# EAGLE schematic quad-hybrid-QCN-19D+ (EAGLE 9.5.1)
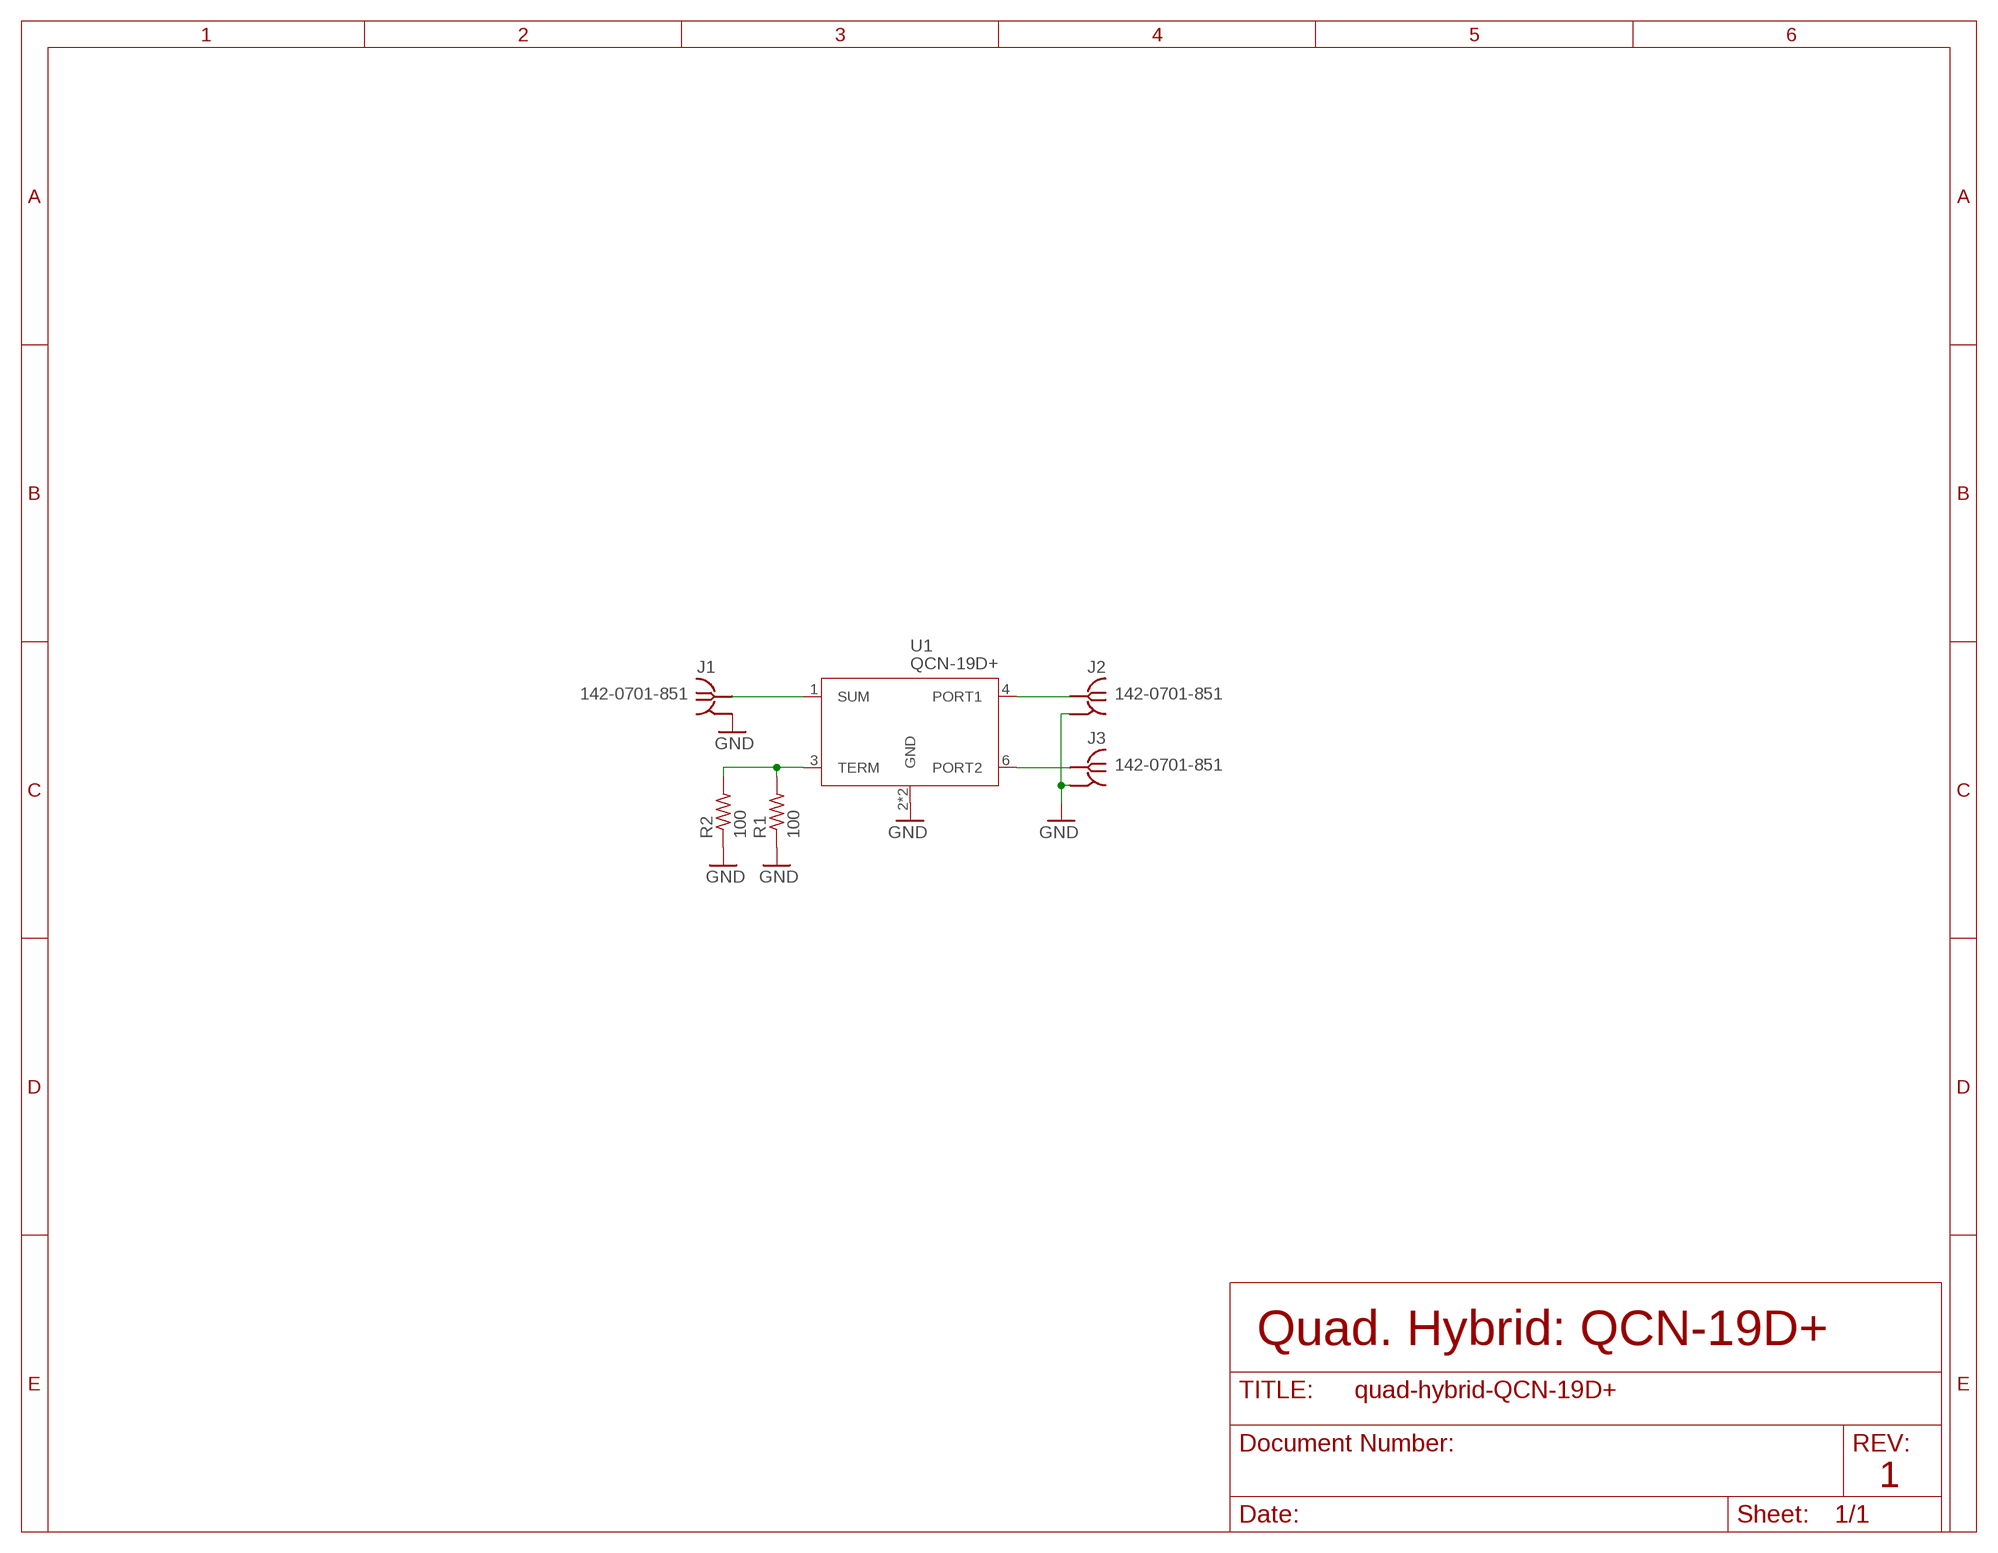
[diagram p0: schematic, sheet 1]

## Parts
J1  142-0701-851  [142-0701-851]
J2  142-0701-851  [142-0701-851]
J3  142-0701-851  [142-0701-851]
R1  100  R-US_0402-C-NOSILK  [.0402-C-NOSILK]
R2  100  R-US_0402-C-NOSILK  [.0402-C-NOSILK]
U1  QCN-19D+  [QCN-19D+]

## Nets
GND: J1.GND1(GND) J1.GND2(GND) J1.GND3(GND) J1.GND4(GND) J2.GND1(GND) J2.GND2(GND) J2.GND3(GND) J2.GND4(GND) J3.GND1(GND) J3.GND2(GND) J3.GND3(GND) J3.GND4(GND) R1.1 R2.1 U1.2(GND) U1.5(GND)
PORT1 [RF]: J2.RF1(RF) U1.4(PORT1)
PORT2 [RF]: J3.RF1(RF) U1.6(PORT2)
SUM [RF]: J1.RF1(RF) U1.1(SUM)
TERM: R1.2 R2.2 U1.3(TERM)

## Notes on the sheet
- Quad. Hybrid: QCN-19D+
- 1

## Library data of the parts
J1-J3 = J-Cinch-142-0701-851-SMA-end-launch:142-0701-851: SMA Jack 50Ω - End Launch Source: Datasheet <https://belfuse.com/resources/productinformations/cinchconnectivitysolutions/johnson/pi-ccs-john-142-0701-851.pdf>
R1 R2 = oresat-rcl:R-US_: RESISTOR, American symbol
U1 = U-MiniCirc-QCN-19+-quad:QCN-19D+: RF Power Splitter/Combiner, Quadrature Hybrid QCN-19D+ 1100 - 1925 MHz Datasheet: Datasheet <https://www.minicircuits.com/pdfs/QCN-19D+.pdf>

## Net classes
1 RF: clearance 0.7 mm